# EAGLE design Diode as a voltage regulatorPCB (EAGLE 9.6.2)
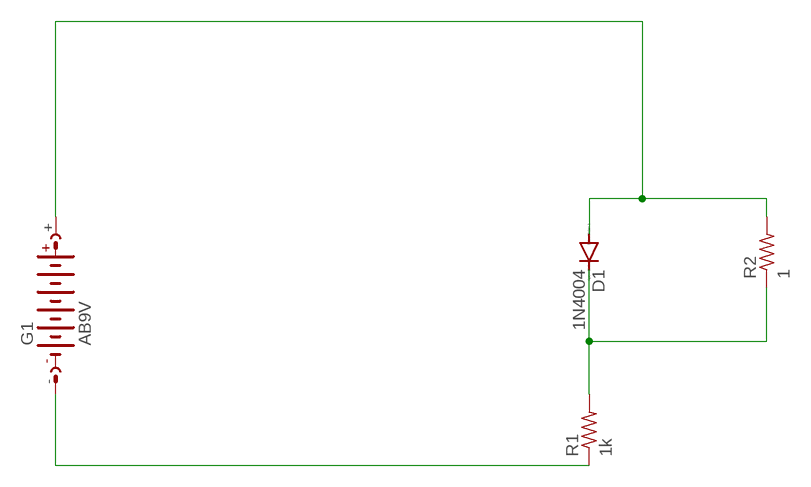
[diagram p0: schematic, sheet 1]

## Parts
D1  1N4004  [DO41-10]
G1  AB9V  [AB9V]
R1  1k  R-US_R0805  [R0805]
R2  1  R-US_R0805  [R0805]

## Nets
N$1: G1.- R1.1
N$2: D1.C R1.2 R2.1
N$3: D1.A G1.+ R2.2

## Library data of the parts
D1 = diode:1N4004: DIODE general purpose rectifier, 1 A
G1 = battery:AB9V: 9-V BATTERY CLIP
R1 R2 = rcl:R-US_: RESISTOR, American symbol; SPICEPREFIX: R

## Board
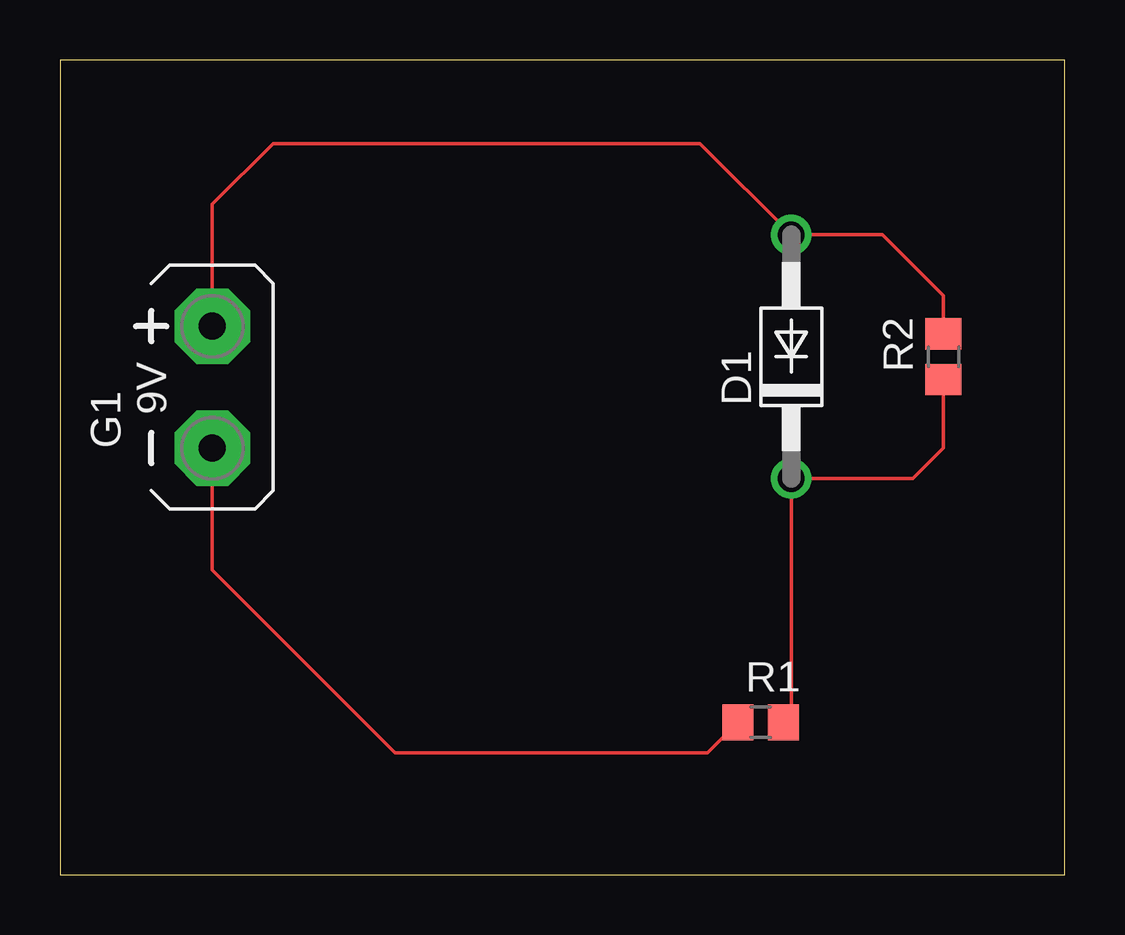
[diagram p1: board, top side]

Size 41.89 x 33.96 mm. Coordinates in mm from the lower left corner, seen from the top.
Outline: 0,0 41.89,0 41.89,33.96 0,33.96 0,0
Copper layers (1*16): Top 0.035mm / dielectric 1.5mm / Bottom 0.035mm
Design rules "default": minimum track width 6mil, minimum drill 0.35mm, track to track 6mil, track to pad 6mil, pad to pad 6mil, via to via 6mil, smd to smd 6mil, copper to edge 40mil, drill to drill 6mil, minimum pad ring 10mil, minimum via ring 8mil, stop-mask expansion 4mil, vias tented up to drill 0mil, thermal gap 10mil

### Footprints (pad centres in the part's own frame; a part is rotated, then mirrored left to right if it is on the bottom)
DO41-10 = drill 1.118: A 5.08,0; C -5.08,0
AB9V = drill 1.118 pad 3.15 octagon: + 0,2.54; - 0,-2.54
R0805 = smd 1.3 x 1.5: 1 -0.95,0; 2 0.95,0

### Placement (x,y rotation side)
D1  30.48,21.59 90 top
G1  6.35,20.32 0 top
R1  29.21,6.35 0 top
R2  36.83,21.59 90 top

### Tracks (layer width: path | path; a pad name or v marks a point on that pad's centre or on a via)
N$1
  Top 0.152: R1.1 26.99,5.08 13.97,5.08 6.35,12.7 G1.-
N$2
  Top 0.152: R2.1 36.83,17.78 35.56,16.51 D1.C 30.48,6.35 R1.2
N$3
  Top 0.152: G1.+ 6.35,27.94 8.89,30.48 26.67,30.48 D1.A 34.29,26.67 36.83,24.13 R2.2